# Altium schematic sheet Mainboard_RMII_Interface.SchDoc
size A4
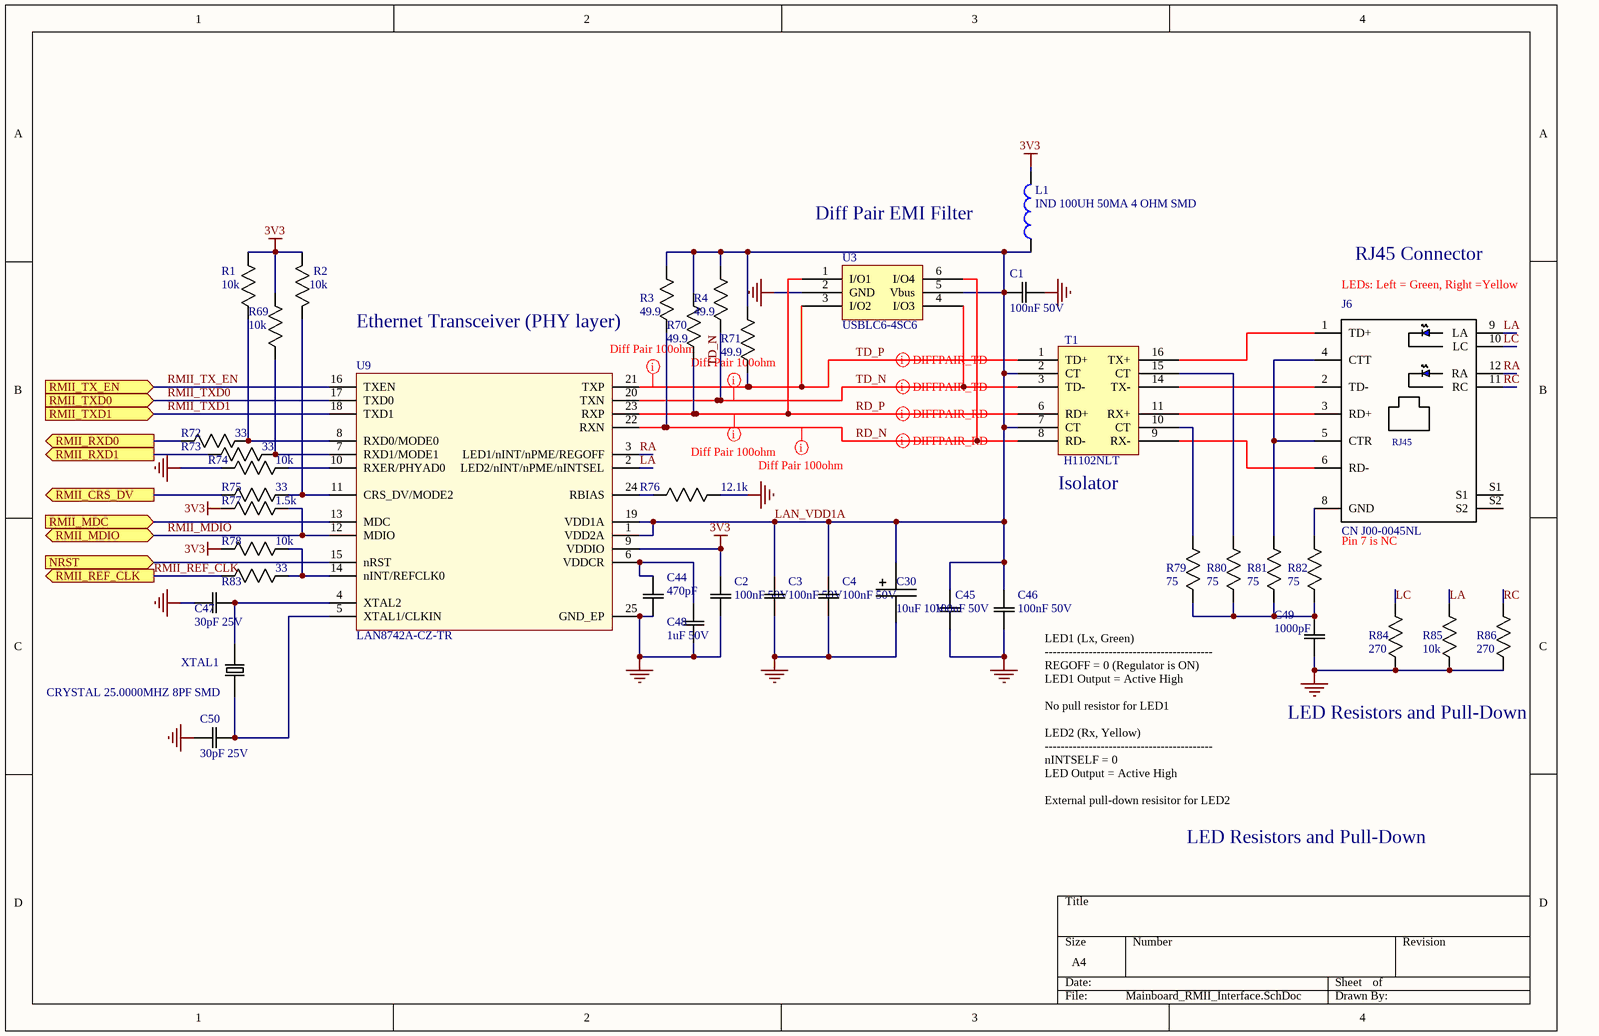
[diagram p0: Mainboard_RMII_Interface.SchDoc]

## Parts
C1  100nF 50V  [0805]
C2  100nF 50V  [0805]
C3  100nF 50V  [0805]
C4  100nF 50V  [0805]
C30  10uF 10V  [1206 Polarized]
C44  470pF  [0805]
C45  100nF 50V  [0805]
C46  100nF 50V  [0805]
C47  30pF 25V  [0805]
C48  1uF 50V  [0805]
C49  1000pF  [0603]
C50  30pF 25V  [0805]
J6  CN J00-0045NL  [RJ45 J00-0045NL]
L1  IND 100UH 50MA 4 OHM SMD  [0805]
R1  10k  [0805]
R2  10k  [0805]
R3  49.9  [0805]
R4  49.9  [0805]
R69  10k  [0805]
R70  49.9  [0805]
R71  49.9  [0805]
R72  33  [0805]
R73  33  [0805]
R74  10k  [0805]
R75  33  [0805]
R76  12.1k  [0805]
R77  1.5k  [0805]
R78  10k  [0805]
R79  75  [0805]
R80  75  [0805]
R81  75  [0805]
R82  75  [0805]
R83  33  [0805]
R84  270  [0805]
R85  10k  [0805]
R86  270  [0805]
T1  H1102NLT  [TRANSFORMER]
U3  USBLC6-4SC6  [SOT23-6L]
U9  LAN8742A-CZ-TR  [24-QFN (4x4)]
XTAL1  CRYSTAL 25.0000MHZ 8PF SMD  [SMD-2]

## Ports
NRST (in), RMII_CRS_DV (out), RMII_MDC (in), RMII_MDIO (bidir), RMII_REF_CLK (out), RMII_RXD0 (out), RMII_RXD1 (out), RMII_TX_EN (in), RMII_TXD0 (in), RMII_TXD1 (in)

## Nets
3V3: C2.2(C2) L1.2 R1.1(R1) R2.1(R1) R69.1(R1) R77.2(R2) R78.2(R2) U9.9(VDDIO)
GND: C1.2(C2) C2.1(C1) C3.1(C1) C4.1(C1) C30.2(P$2) C44.1(C1) C45.1(C1) C46.1(C1) C47.1(C1) C48.1(C1) C49.1(C1) C50.1(C1) R74.2(R2) R76.1(R1) R84.2(R2) R85.2(R2) R86.2(R2) U3.2(GND) U9.25(GND_EP)
LA: J6.9(LA) R85.1(R1) U9.2(LED2/nINT/nPME/nINTSEL)
LAN_VDD1A: C1.1(C1) C3.2(C2) C4.2(C2) C30.1(P$1) C45.2(C2) C46.2(C2) L1.1 R3.1(R1) R4.1(R1) R70.1(R1) R71.1(R1) T1.2(CT) T1.7(CT) U3.5(Vbus) U9.1(VDD2A) U9.19(VDD1A)
LC: J6.10(LC) R84.1(R1)
NRST: U9.15(nRST) ; port NRST
RA: J6.12(RA) U9.3(LED1/nINT/nPME/REGOFF)
RC: J6.11(RC) R86.1(R1)
RD_N: R3.2(R2) T1.8(RD-) U3.6(I/O4) U9.22(RXN)
RD_P: R70.2(R2) T1.6(RD+) U3.1(I/O1) U9.23(RXP)
RMII_CRS_DV: R75.2(R2) ; port RMII_CRS_DV
RMII_MDC: U9.13(MDC) ; port RMII_MDC
RMII_MDIO: R77.1(R1) U9.12(MDIO) ; port RMII_MDIO
RMII_REF_CLK: R83.2(R2) ; port RMII_REF_CLK
RMII_RXD0: R72.2(R2) ; port RMII_RXD0
RMII_RXD1: R73.2(R2) ; port RMII_RXD1
RMII_TX_EN: U9.16(TXEN) ; port RMII_TX_EN
RMII_TXD0: U9.17(TXD0) ; port RMII_TXD0
RMII_TXD1: U9.18(TXD1) ; port RMII_TXD1
TD_N: R4.2(R2) T1.3(TD-) U3.4(I/O3) U9.20(TXN)
TD_P: R71.2(R2) T1.1(TD+) U3.3(I/O2) U9.21(TXP)
NetC44_2: C44.2(C2) C48.2(C2) U9.6(VDDCR)
NetC47_2: C47.2(C2) U9.4(XTAL2) XTAL1.2
NetC49_2: C49.2(C2) R79.2(R2) R80.2(R2) R81.2(R2) R82.2(R2)
NetC50_2: C50.2(C2) U9.5(XTAL1/CLKIN) XTAL1.1
NetJ6_1: J6.1(TD+) T1.16(TX+)
NetJ6_2: J6.2(TD-) T1.14(TX-)
NetJ6_3: J6.3(RD+) T1.11(RX+)
NetJ6_4: J6.4(CTT) J6.5(CTR) R81.1(R1)
NetJ6_6: J6.6(RD-) T1.9(RX-)
NetJ6_8: J6.8(GND) R82.1(R1)
NetR1_2: R1.2(R2) R72.1(R1) U9.8(RXD0/MODE0)
NetR2_2: R2.2(R2) R75.1(R1) U9.11(CRS_DV/MODE2)
NetR69_2: R69.2(R2) R73.1(R1) U9.7(RXD1/MODE1)
NetR74_1: R74.1(R1) U9.10(RXER/PHYAD0)
NetR76_2: R76.2(R2) U9.24(RBIAS)
NetR78_1: R78.1(R1) R83.1(R1) U9.14(nINT/REFCLK0)
NetR79_1: R79.1(R1) T1.10(CT)
NetR80_1: R80.1(R1) T1.15(CT)

Not connected (* = marked no-connect by the designer): J6 S1 S2

## Layout directives
differential pair: RD_N, RD_P, TD_N, TD_P
rule Matched Net Lengths [Tolerance = 100mil]: RD_N, RD_P, TD_N, TD_P

## Notes on the sheet
- (near L1) Diff Pair EMI Filter
- (near J6) LEDs: Left = Green, Right =Yellow
- RJ45 Connector
- (near R3) Ethernet Transceiver (PHY layer)
- (near T1) Isolator
- Pin 7 is NC
- LED Resistors and Pull-Down
- LED1 (Lx, Green)
  ------------------------------------------
  REGOFF = 0 (Regulator is ON)
  LED1 Output = Active High
  No pull resistor for LED1
  LED2 (Rx, Yellow)
  ------------------------------------------
  nINTSELF = 0
  LED Output = Active High
  External pull-down resisitor for LED2
- (in symbol CN MAGJACK) RJ45

## Library data of the parts
C1-C4 C45 C46 = CAP 100nF 50V: CAP CER 0.1UF 50V X7R 0805; Tolerance: 10%; Package: 0805; Value: 100nF; Rating: 50V
C30 = CAP TANT 10uF 10V: CAP TANT 10UF 10V 1206; Tolerance: 10%; ESR (Equivalent Series Resistance): 3.8 Ohm; Type: Molded Tantalum; Package: 1206; Value: 10uF; Rating: 10V; Operating Temperature: -55°C ~ 125°C
C44 = CAP 470pF 50V: CAP CER 470PF 50V X7R 0603/0805; Tolerance: 10%; Package: 0603/0805; Value: 470pF; Rating: 50V; Temperature Coefficient: X7R; Operating Temperature: -55°C ~ 125°C
C47 C50 = CAP 30pF 25V: CAP CER 30PF 25V NP0 0805; Tolerance: 20%; Package: 0805; Value: 30pF; Rating: 25V
C48 = CAP 1uF 50V: CAP CER 1UF 50V X7R 0805; Tolerance: 10%; Package: 0805; Value: 1uF; Rating: 50V; Temperature Coefficient: X7R; Operating Temperature: -55°C ~ 125°C
C49 = CAP 1000pF 50V: CAP CER 1000PF 50V X7R 0603/0805; Tolerance: 10%; Package: 0603/0805; Value: 1000pF; Rating: 50V; Temperature Coefficient: X7R; Operating Temperature: -55°C ~ 125°C
J6 = CN MAGJACK: CN MAGJACK 1PORT 100 BASE-TX; MF: Pulse Electronics; Package: None; SnapEDA_Link: https://www.snapeda.com/parts/J00-0045NL/Pulse%20Electronics%20Network/view-part/87956/?ref=snap; MP: J00-0045NL; Value: *; Digikey Link: https://www.digikey.com/product-detail/en/pulse-electronics-network/J00-0045NL/553-1619-5-ND/1036860?utm_source=snapeda&utm_medium=aggregator&utm_campaign=symbol; Digikey: 553-1619-5-ND; Supplier 1: Mouser; Supplier Part Number 1: 673-J00-0045NL
L1 = IND 100UH 50MA 4 OHM SMD: 100µH Unshielded Wirewound Inductor 50mA 4Ohm 0805 (2012 Metric); MF: Taiyo Yuden; MP: LBR2012T101K; Revision: July-2002: Re-released for DXP Platform.; Value: 100uH; Digikey: 587-2048-1-ND; Digikey Link: https://www.digikey.ca/product-detail/en/taiyo-yuden/LBR2012T101K/587-2048-1-ND/1788995; Supplier 1: Digi-Key; Supplier Part Number 1: 587-4040-1-ND
R1 R2 R69 R74 R78 R85 = RES 10k 1/8W - 1%: RES SMD 10K OHM 1% 1/8W 0805; Power (Watts): 0.125W; Package: 0805; Value: 10k; Tolerance: 1%
R3 R4 R70 R71 = RES 49.9 1/8W: RES SMD 49.9 OHM 1% 1/8W 0805; Power (Watts): 0.125W; Package: 0805; Value: 49.9; Tolerance: 1%
R72 R73 R75 R83 = RES 33.0 1/8W - 1%: RES SMD 33 OHM 1% 1/8W 0805; Power (Watts): 0.125W; Package: 0805; Value: 33; Tolerance: 1%
R76 = RES 12.1k 1/8W: RES SMD 12.1K OHM 1% 1/8W 0805; Power (Watts): 0.125W; Package: 0805; Value: 12.1k; Tolerance: 1%
R77 = RES 1.5k 1/8W - 1%: RES SMD 1.5K OHM 1% 1/8W 0805; Power (Watts): 0.125W; Package: 0805; Value: 1.5k; Tolerance: 1%; ComponentLink1Description: digikey; ComponentLink1URL: https://www.digikey.ca/en/products/detail/panasonic-electronic-components/ERJ-6ENF1022V/111476
R79-R82 = RES 75.0 1/8W - 1%: RES SMD 75 OHM 1% 1/8W 0805; Power (Watts): 0.125W; Package: 0805; Value: 75; Tolerance: 1%
R84 R86 = RES 270.0 1/8W: RES SMD 270 OHM 5% 1/8W 0805; Power (Watts): 0.125W; Package: 0805; Value: 270; Tolerance: 5%
T1 = XFRMR H1102NLT: Isolation and Data Interface (Encapsulated) Pulse Transformer 1:1 Transmitter, 1:1 Receiver Surface Mount; MF: Pulse Electronics; Package: SOIC-16; Price: 7.99 CAD; MP: H1102NL; Digikey: 553-1323-5-ND; Digikey Link: https://www.digikey.ca/en/products/detail/pulse-electronics-network/H1102NL/1036940?s=N4IgTCBcDaIBIEYEAYwDkAyIC6BfIA; Supplier 1: Digi-Key; Supplier Part Number 1: 553-1323-5-ND
U9 = LAN8742A-CZ-TR: LAN8742A-CZ-TR - Small Footprint RMII 10/100 Ethernet, Transceiver with HP Auto-MDIX and flexPWR Technology SQFN-24; MF: Microchip Technology; MP: LAN8742A-CZ-TR; Digikey: LAN8742A-CZ-CT-ND; Digikey Link: https://www.digikey.ca/product-detail/en/microchip-technology/LAN8742A-CZ-TR/LAN8742A-CZ-CT-ND/8256089; Supplier 1: Digi-Key; Supplier Part Number 1: LAN8742A-CZ-CT-ND
XTAL1 = XTAL 25MHZ 8PF SMD: 25MHz ±50ppm Crystal 8pF 70 Ohms 2-SMD, No Lead; MP: NX5032GA-25.000000MHZ-LN-CD-1; MF: NDK America, Inc.; ESR: 70 Ohms; Package: 2-SMD, No Lead; Price: 0.95 CAD; Frequency: 25MHz; Digikey: 644-1041-1-ND; Digikey Link: https://www.digikey.ca/product-detail/en/ndk-america-inc/NX5032GA-25.000000MHZ-LN-CD-1/644-1041-1-ND/1128913; Load Capacitance: 8pF; Supplier 1: Digi-Key; Supplier Part Number 1: 644-1041-1-ND